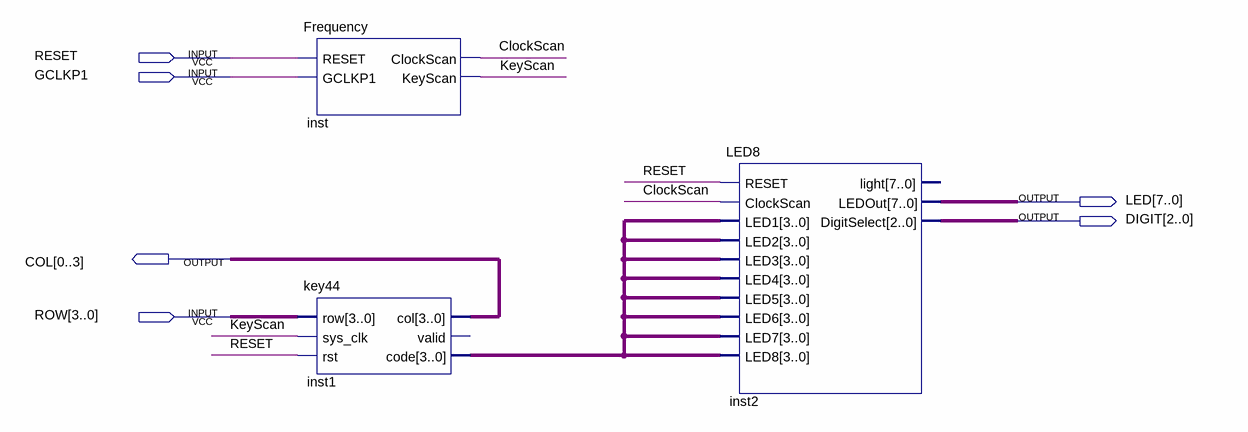
[diagram p0: schematic sheet]
// Quartus schematic KeyBoard.bdf as structural Verilog: 3 symbols, 6 pins
module KeyBoard (
  input  RESET,
  input  GCLKP1,
  input  [3:0] ROW,
  output [7:0] LED,
  output [2:0] DIGIT,
  output [0:3] COL
);

  wire ClockScan, KeyScan;
  wire [3:0] inst1_code;

  Frequency inst (.RESET(RESET), .GCLKP1(GCLKP1), .ClockScan(ClockScan), .KeyScan(KeyScan));
  key44 inst1 (.row(ROW), .sys_clk(KeyScan), .rst(RESET), .col(COL), .code(inst1_code));  // open: valid
  LED8 inst2 (
    .RESET(RESET), .ClockScan(ClockScan), .LED1(inst1_code), .LED2(inst1_code), .LED3(inst1_code),
    .LED4(inst1_code), .LED5(inst1_code), .LED6(inst1_code), .LED7(inst1_code), .LED8(inst1_code),
    .LEDOut(LED), .DigitSelect(DIGIT));  // open: light
endmodule
